# EAGLE design autonomous_vehicle_controller (EAGLE 7.1.0)
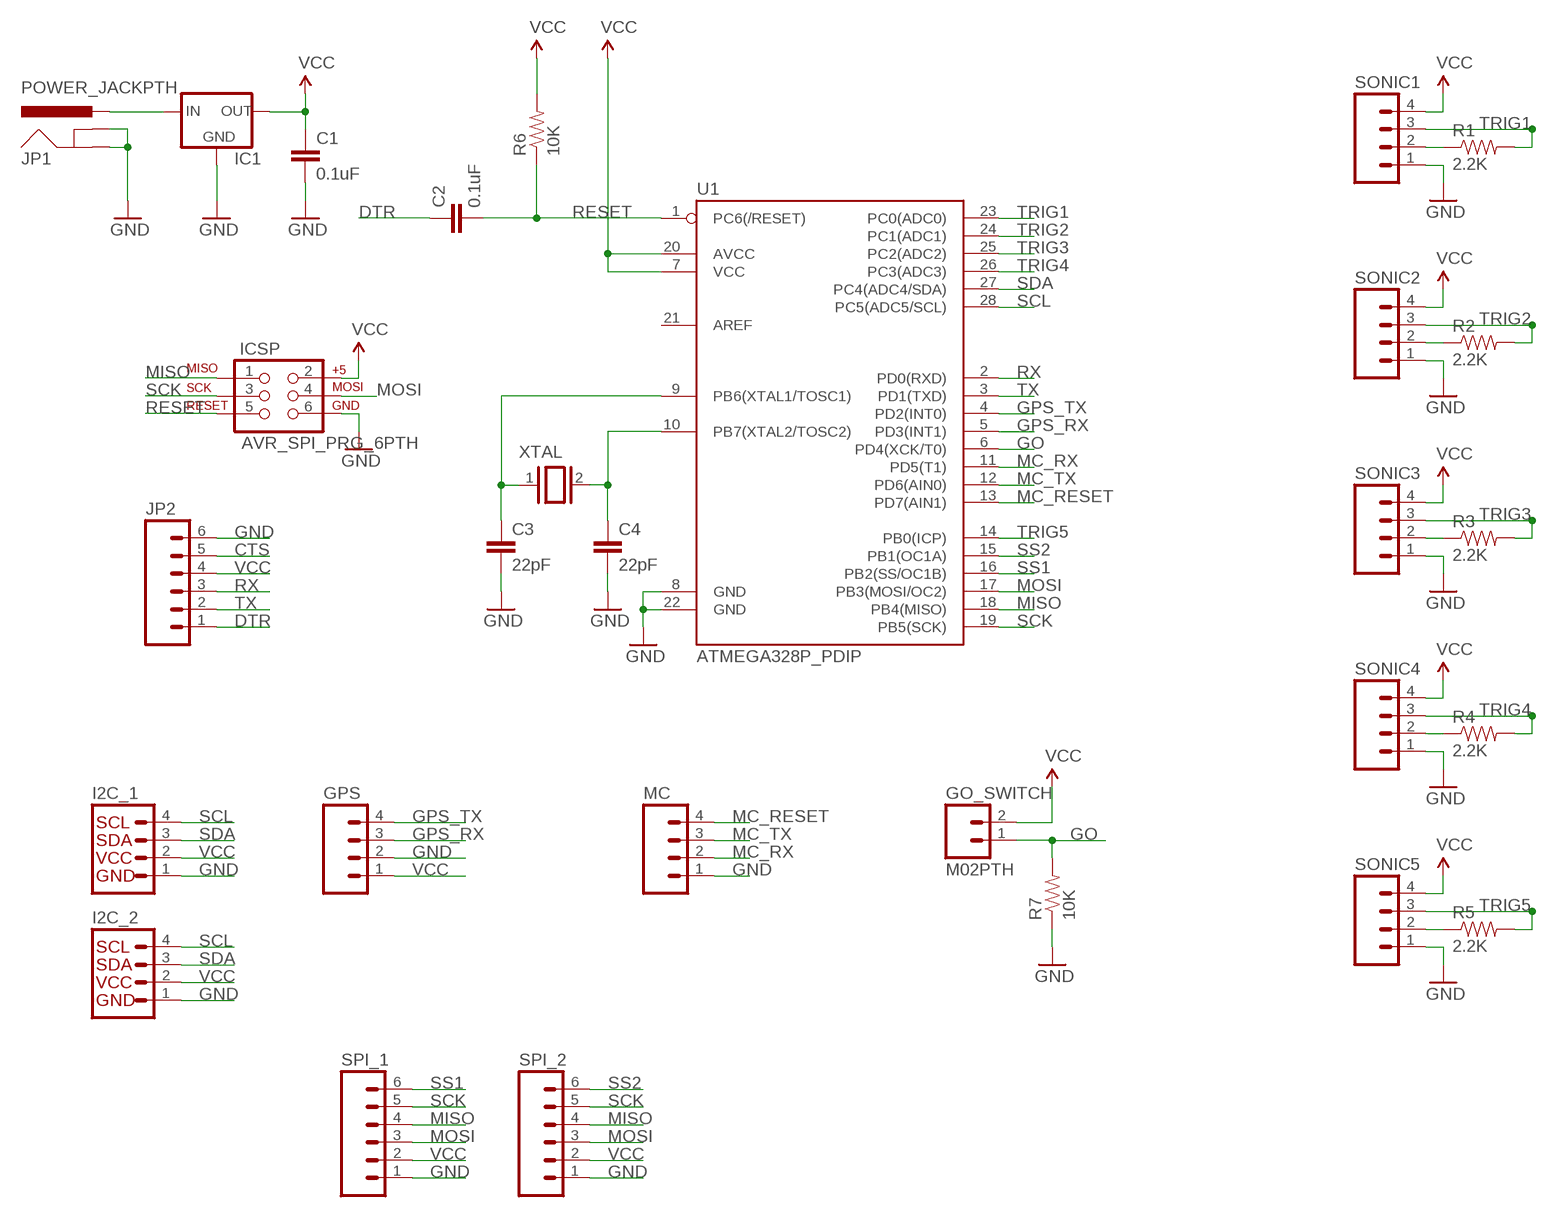
[diagram p0: schematic, sheet 1]

## Parts
C1  0.1uF  CAPPTH  [CAP-PTH-SMALL]
C2  0.1uF  CAPPTH  [CAP-PTH-SMALL]
C3  22pF  CAPPTH  [CAP-PTH-SMALL]
C4  22pF  CAPPTH  [CAP-PTH-SMALL]
GO_SWITCH  M02PTH  [1X02]
GPS  M04PTH  [1X04]
I2C_1  I2C_STANDARD  [1X04]
I2C_2  I2C_STANDARD  [1X04]
IC1  V_REG_78XXSIDE  [78XXL]
ICSP  AVR_SPI_PRG_6PTH  [2X3]
JP1  POWER_JACKPTH  [POWER_JACK_PTH]
JP2  M06SILK_FEMALE_PTH  [1X06]
MC  M04PTH  [1X04]
R1  2.2K  RESISTORPTH-1/4W  [AXIAL-0.4]
R2  2.2K  RESISTORPTH-1/4W  [AXIAL-0.4]
R3  2.2K  RESISTORPTH-1/4W  [AXIAL-0.4]
R4  2.2K  RESISTORPTH-1/4W  [AXIAL-0.4]
R5  2.2K  RESISTORPTH-1/4W  [AXIAL-0.4]
R6  10K  RESISTORPTH-1/4W  [AXIAL-0.4]
R7  10K  RESISTORPTH-1/4W  [AXIAL-0.4]
SONIC1  M04PTH  [1X04]
SONIC2  M04PTH  [1X04]
SONIC3  M04PTH  [1X04]
SONIC4  M04PTH  [1X04]
SONIC5  M04PTH  [1X04]
SPI_1  M06SILK_FEMALE_PTH  [1X06]
SPI_2  M06SILK_FEMALE_PTH  [1X06]
U1  ATMEGA328P_PDIP  [DIL28-3]
XTAL  XTAL/S  [QS]

## Nets
CTS: JP2.5
DTR: C2.1 JP2.1
GND: C1.2 C3.2 C4.2 GPS.2 I2C_1.1 I2C_2.1 IC1.GND ICSP.6 JP1.GND JP1.GNDBREAK JP2.6 MC.1 R7.P$1 SONIC1.1 SONIC2.1 SONIC3.1 SONIC4.1 SONIC5.1 SPI_1.1 SPI_2.1 U1.8(GND) U1.22(GND)
GO: GO_SWITCH.1 R7.P$2 U1.6(PD4(XCK/T0))
GPS_RX: GPS.3 U1.5(PD3(INT1))
GPS_TX: GPS.4 U1.4(PD2(INT0))
MC_RESET: MC.4 U1.13(PD7(AIN1))
MC_RX: MC.2 U1.11(PD5(T1))
MC_TX: MC.3 U1.12(PD6(AIN0))
MISO: ICSP.1 SPI_1.4 SPI_2.4 U1.18(PB4(MISO))
MOSI: ICSP.4 SPI_1.3 SPI_2.3 U1.17(PB3(MOSI/OC2))
N$1: IC1.IN JP1.PWR
N$2: C3.1 U1.9(PB6(XTAL1/TOSC1)) XTAL.1
N$3: R2.P$1 SONIC2.2
N$4: R1.P$1 SONIC1.2
N$5: R3.P$1 SONIC3.2
N$6: R4.P$1 SONIC4.2
N$7: R5.P$1 SONIC5.2
N$8: C4.1 U1.10(PB7(XTAL2/TOSC2)) XTAL.2
RESET: C2.2 ICSP.5 R6.P$1 U1.1(PC6(/RESET))
RX: JP2.3 U1.2(PD0(RXD))
SCK: ICSP.3 SPI_1.5 SPI_2.5 U1.19(PB5(SCK))
SCL: I2C_1.4 I2C_2.4 U1.28(PC5(ADC5/SCL))
SDA: I2C_1.3 I2C_2.3 U1.27(PC4(ADC4/SDA))
SS1: SPI_1.6 U1.16(PB2(SS/OC1B))
SS2: SPI_2.6 U1.15(PB1(OC1A))
TRIG1: R1.P$2 SONIC1.3 U1.23(PC0(ADC0))
TRIG2: R2.P$2 SONIC2.3 U1.24(PC1(ADC1))
TRIG3: R3.P$2 SONIC3.3 U1.25(PC2(ADC2))
TRIG4: R4.P$2 SONIC4.3 U1.26(PC3(ADC3))
TRIG5: R5.P$2 SONIC5.3 U1.14(PB0(ICP))
TX: JP2.2 U1.3(PD1(TXD))
VCC: C1.1 GO_SWITCH.2 GPS.1 I2C_1.2 I2C_2.2 IC1.OUT ICSP.2 JP2.4 R6.P$2 SONIC1.4 SONIC2.4 SONIC3.4 SONIC4.4 SONIC5.4 SPI_1.2 SPI_2.2 U1.7(VCC) U1.20(AVCC)
Unconnected: U1.21(AREF)

## Library data of the parts
C1 C2 = SparkFun-Capacitors:CAP: Capacitor Standard 0603 ceramic capacitor, and 0.1" leaded capacitor.
C3 C4 = SparkFun-Passives:CAP: Capacitor Standard 0603 ceramic capacitor, and 0.1" leaded capacitor.
GO_SWITCH = SparkFun-Connectors:M02: Standard 2-pin 0.1" header. Use with - straight break away headers ( PRT-00116) - right angle break away headers (PRT-00553) - swiss pins (PRT-00743) - machine pins (PRT-00117) - female headers (PRT-00115) Molex polarized connector foot print use with: PRT-08233 with associated crimp pins and housings. 2.54_SCREWTERM for use with PRT-10571. 3.5mm Screw Terminal footprints for PRT-08084 5mm Screw Terminal footprints for use with PRT-08432
GPS MC SONIC1-SONIC5 = SparkFun-Connectors:M04: Header 4 Standard 4-pin 0.1" header. Use with straight break away headers (SKU : PRT-00116), right angle break away headers (PRT-00553), swiss pins (PRT-00743), machine pins (PRT-00117), and female headers (PRT-00115). Molex polarized connector foot print use with SKU : PRT-08231 with associated crimp pins and housings. 1MM SMD Version SKU: PRT-10208
I2C_1 I2C_2 = SparkFun-Connectors:I2C_STANDARD: SparkFun has standardized on a pinout for all I2C based sensor breakouts. This pinout allows I2C boards to be plugged directly into the headers on Arduino Uno compatible boards, and to be daisy chained easily.
IC1 = SparkFun-PowerIC:V_REG_78XX: Voltage Regulator Standard 7805 5V regulator. IGO (Input Ground Output). Spark Fun Electronics SKU : COM-00107
ICSP = SparkFun-Connectors:AVR_SPI_PRG_6: AVR ISP 6 Pin This is the reduced ISP connector for AVR programming. Common on Arduino. This footprint will take up less PCB space and can be used with a 10-pin to 6-pin adapter such as SKU: BOB-08508 **Special note about "TEST_POINT" package. The stop mask is on the top side, so if you want your programming test points to be on the bottom of your board, make sure to place this package on the bottom side of the board. This also ensure that the orientation to program from the bottom side will be correct.
JP1 = SparkFun-Connectors:POWER_JACK: Power Jack This is the standard 5.5mm barrel jack for power. The PTH is the most common, proven, reliable, footprint. The Slot footprint only works if the mill layer is transmitted to the PCB fab house so be warned. Mating wall wart : TOL-00298 (and others); PROD_ID: CONN-08197
JP2 SPI_1 SPI_2 = SparkFun-Connectors:M06: Header 6 Standard 6-pin 0.1" header. Use with straight break away headers (SKU : PRT-00116), right angle break away headers (PRT-00553), swiss pins (PRT-00743), machine pins (PRT-00117), and female headers (PRT-00115). Molex polarized connector foot print use with SKU : PRT-08094 with associated crimp pins and housings. NOTES ON THE VARIANTS LOCK and LOCK_LONGPADS... This footprint was designed to help hold the alignment of a through-hole component (i.e. 6-pin header) while soldering it into place. You may notice that each hole has been shifted either up or down by 0.005 of an inch from it's more standard position (which is a perfectly straight line). This slight alteration caused the pins (the squares in the middle) to touch the edges of the holes. Because they are alternating, it causes a "brace" to hold the component in place. 0.005 has proven to be the perfect amount of "off-center" position when using our standard breakaway headers. Although looks a little odd when you look at the bare footprint, once you have a header in there, the alteration is very hard to notice. Also,if you push a header all the way into place, it is covered up entirely on the bottom side. This idea of altering the position of holes to aid alignment will be further integrated into the Sparkfun Library for other footprints. It can help hold any component with 3 or more connection pins.; PROD_ID: CONN-08437
R1-R7 = SparkFun-Passives:RESISTOR: Resistor Basic schematic elements and footprints for 0603, 1206, and PTH resistors.
U1 = SparkFun-DigitalIC:ATMEGA328P_PDIP: uC used in the Arduino 32kb flash, 1k EEPROM, 2k SRAM This is the through-hole version of this chip.
XTAL = special:XTAL/S: CRYSTAL

## Board
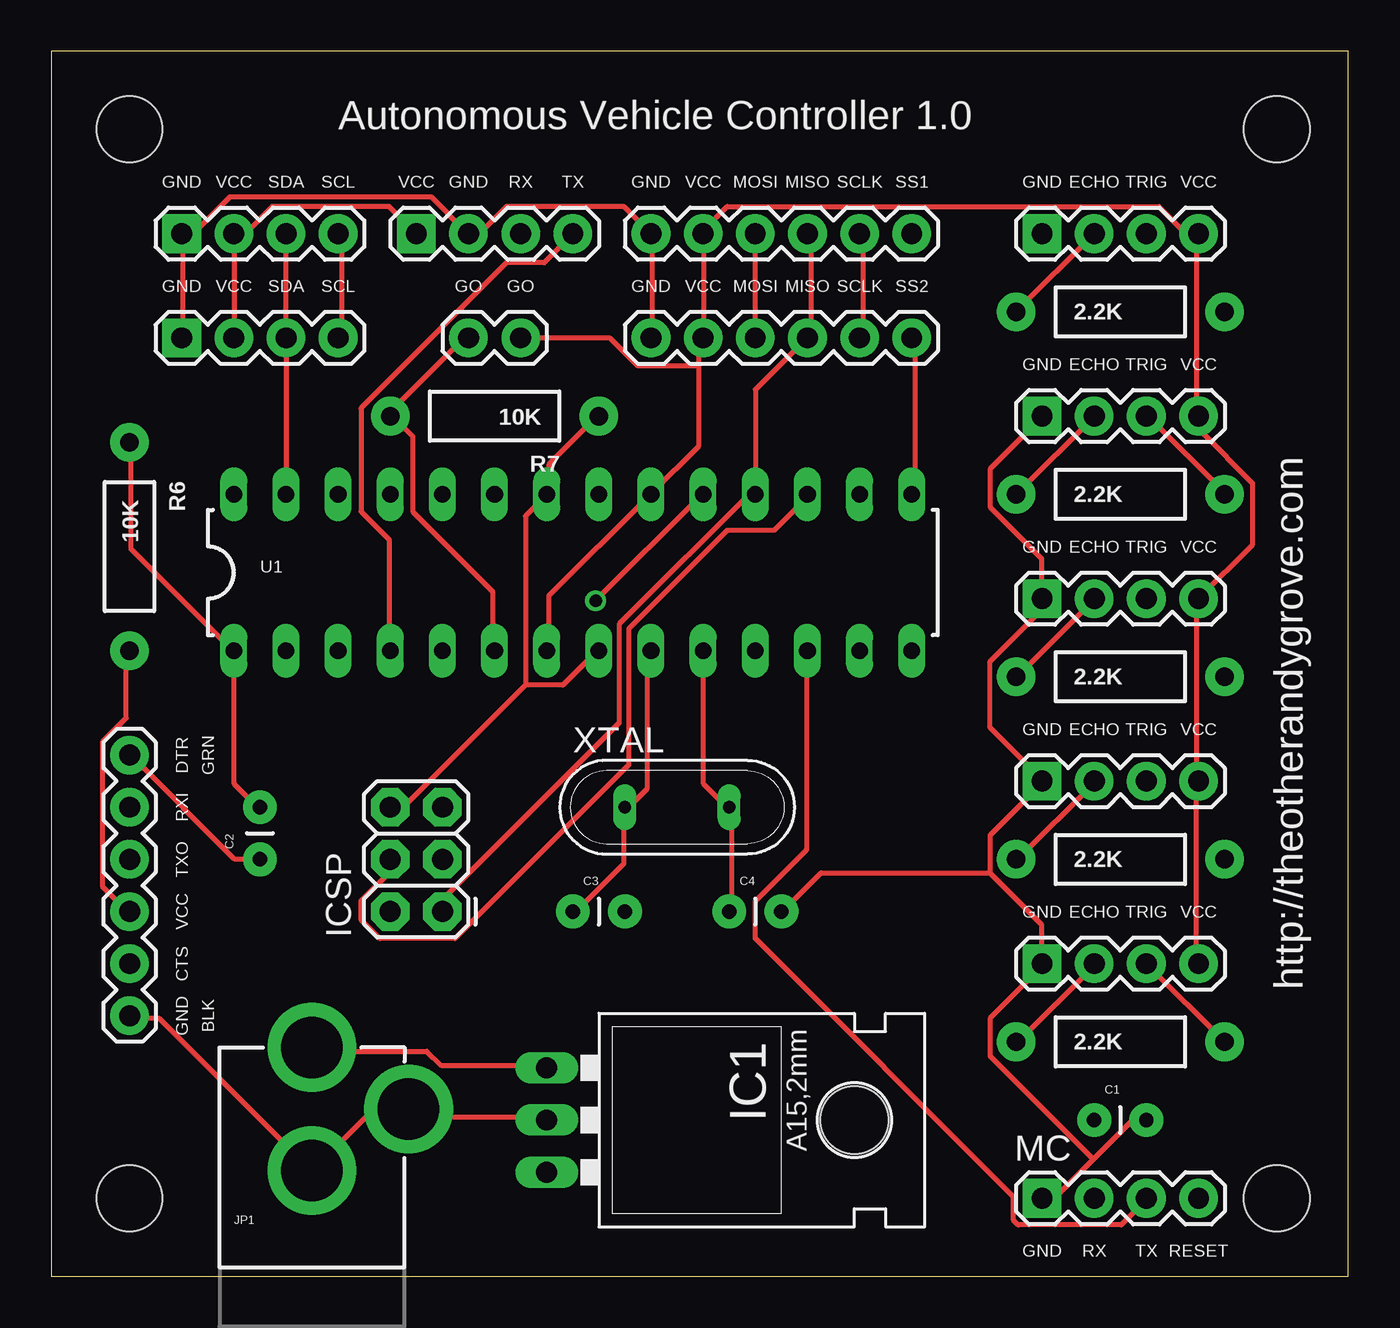
[diagram p1: board, top side]
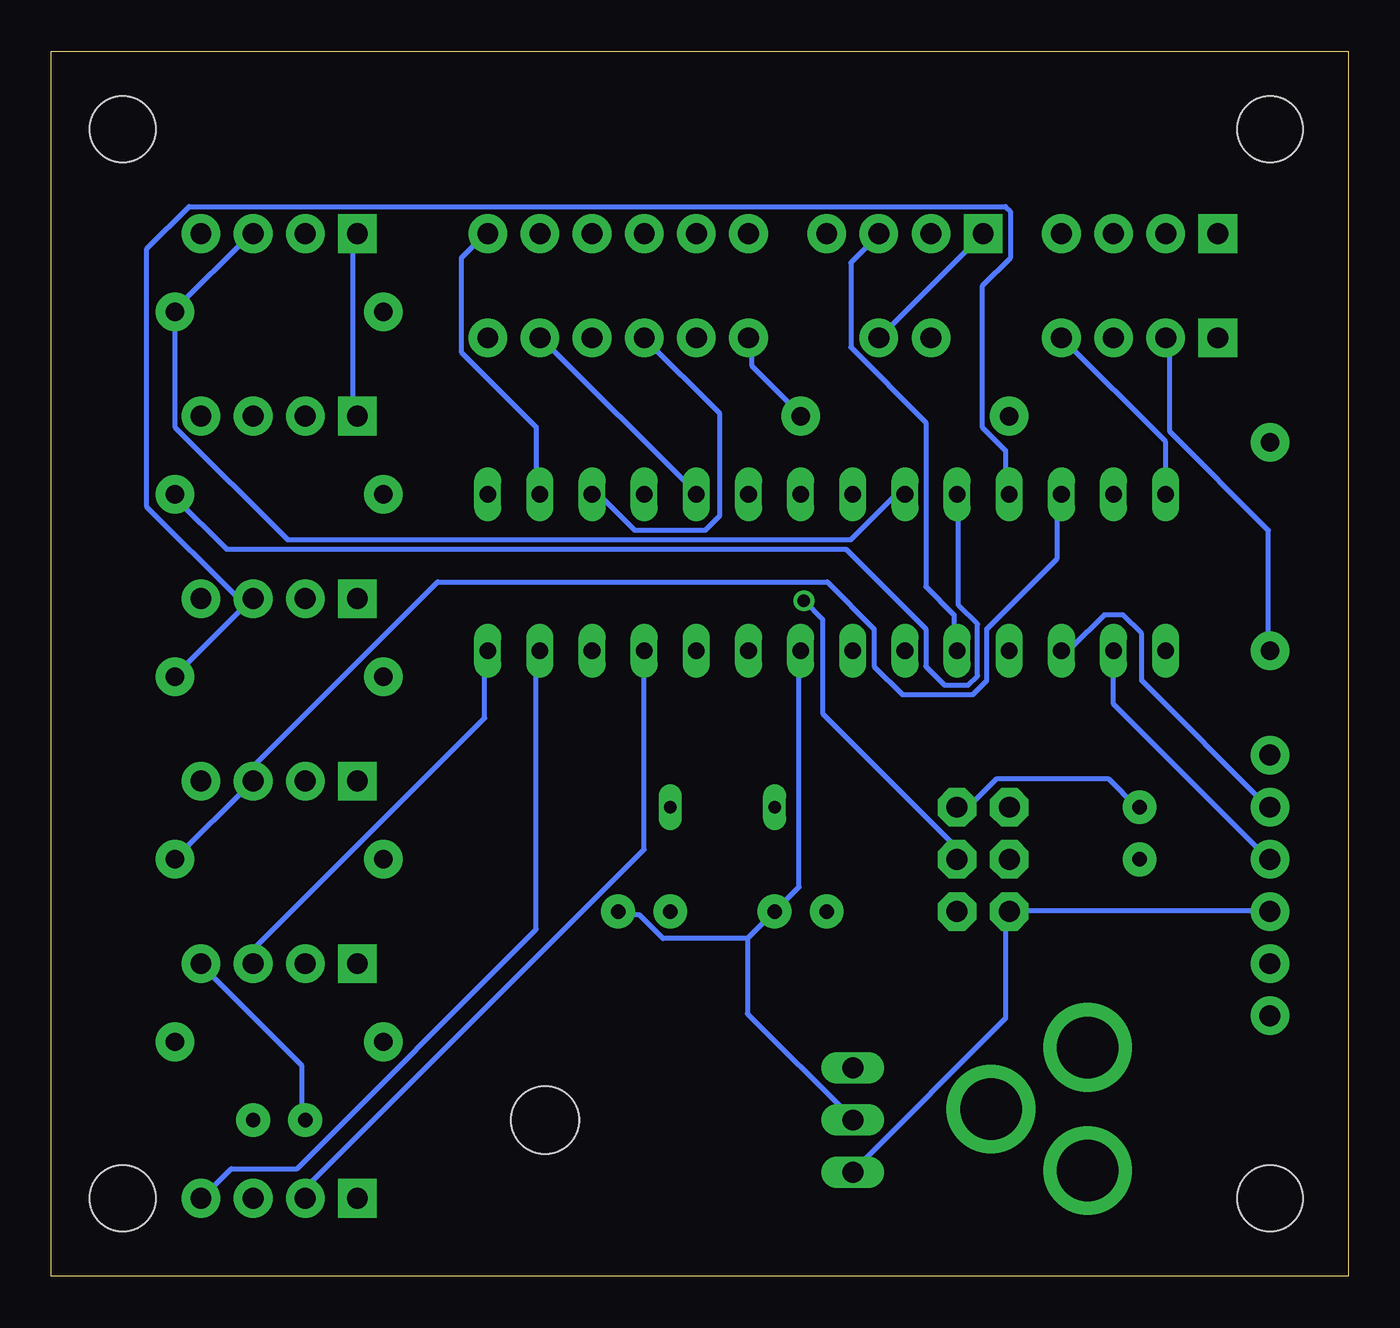
[diagram p2: board, bottom side, seen from below]

Size 63.17 x 59.68 mm. Coordinates in mm from the lower left corner, seen from the top.
Outline: 0,0 63.17,0 63.17,59.68 0,59.68 0,0
Copper layers (1*16): Top 0.035mm / dielectric 1.5mm / Bottom 0.035mm
Design rules "default": minimum track width 10mil, minimum drill 24mil, track to track 8mil, track to pad 8mil, pad to pad 8mil, via to via 8mil, smd to smd 8mil, copper to edge 40mil, drill to drill 8mil, minimum pad ring 10mil, minimum via ring 8mil, stop-mask expansion 4mil, vias tented up to drill 0mil, thermal gap 10mil
Holes 3.2 mm at 3.81,55.88 59.69,55.88 59.69,3.81 3.81,3.81

### Footprints (pad centres in the part's own frame; a part is rotated, then mirrored left to right if it is on the bottom)
CAP-PTH-SMALL = drill 0.7 pad 1.651: 1 0,0; 2 2.54,0
1X02 = drill 1.016 pad 1.88: 1 0,0; 2 2.54,0
1X04 = drill 1.016 pad 1.88 square: 1 0,0 | drill 1.016 pad 1.88: 2 2.54,0; 3 5.08,0; 4 7.62,0
78XXL = drill 1.016 long: GND 0,-3.81; IN -2.54,-3.81; OUT 2.54,-3.81 | hole 3.302: 0,11.176
2X3 = drill 1.016 pad 1.88 octagon: 1 0,0; 2 0,2.54; 3 2.54,0; 4 2.54,2.54; 5 5.08,0; 6 5.08,2.54
POWER_JACK_PTH = drill 2.997 pad 4.318: GND 0,7.7; GNDBREAK 4.7,10.7; PWR 0,13.7
1X06 = drill 1.016 pad 1.88: 1 0,0; 2 2.54,0; 3 5.08,0; 4 7.62,0; 5 10.16,0; 6 12.7,0
AXIAL-0.4 = drill 0.9 pad 1.88: P$1 -5.08,0; P$2 5.08,0
DIL28-3 = drill 0.813 long: 1 -16.51,-3.81; 2 -13.97,-3.81; 3 -11.43,-3.81; 4 -8.89,-3.81; 5 -6.35,-3.81; 6 -3.81,-3.81; 7 -1.27,-3.81; 8 1.27,-3.81; 9 3.81,-3.81; 10 6.35,-3.81; 11 8.89,-3.81; 12 11.43,-3.81; 13 13.97,-3.81; 14 16.51,-3.81; 15 16.51,3.81; 16 13.97,3.81; 17 11.43,3.81; 18 8.89,3.81; 19 6.35,3.81; 20 3.81,3.81; 21 1.27,3.81; 22 -1.27,3.81; 23 -3.81,3.81; 24 -6.35,3.81; 25 -8.89,3.81; 26 -11.43,3.81; 27 -13.97,3.81; 28 -16.51,3.81
QS = drill 0.61 long: 1 -2.54,0; 2 2.54,0

### Placement (x,y rotation side)
C1  50.8,7.62 0 top
C2  10.16,20.32 90 top
C3  25.4,17.78 0 top
C4  33.02,17.78 0 top
GO_SWITCH  20.32,45.72 0 top
GPS  17.78,50.8 0 top
I2C_1  6.35,50.8 0 top
I2C_2  6.35,45.72 0 top
IC1  27.94,7.62 270 top
ICSP  19.05,17.78 90 top
JP1  12.7,-2.54 0 top
JP2  3.81,25.4 270 top
MC  48.26,3.81 0 top
R1  52.07,46.99 0 top
R2  52.07,38.1 0 top
R3  52.07,29.21 0 top
R4  52.07,20.32 0 top
R5  52.07,11.43 0 top
R6  3.81,35.56 270 top
R7  21.59,41.91 180 top
SONIC1  48.26,50.8 0 top
SONIC2  48.26,41.91 0 top
SONIC3  48.26,33.02 0 top
SONIC4  48.26,24.13 0 top
SONIC5  48.26,15.24 0 top
SPI_1  29.21,50.8 0 top
SPI_2  29.21,45.72 0 top
U1  25.4,34.29 0 top
XTAL  30.48,22.86 0 top

### Tracks (layer width: path | path; a pad name or v marks a point on that pad's centre or on a via)
DTR
  Top 0.254: C2.1 10.06,20.34 8.91,20.34 3.89,25.38 JP2.1
GND
  Top 0.254: SONIC2.1 48.23,41.83 45.72,39.32 45.72,37.49 48.23,34.98 48.23,33.15 SONIC3.1 48.23,32.92 48.23,32.46 45.72,29.95 45.72,26.75 48.23,24.23 SONIC4.1 48.23,24 45.72,21.49 45.72,19.66 | 50.75,5.71 48.92,3.89 48.46,3.89 MC.1 | 50.75,5.71 52.58,7.54 53.26,7.54 C1.2 | 45.72,19.66 48.23,17.14 48.23,15.32 SONIC5.1 48.23,15.09 45.72,12.57 45.72,10.74 50.75,5.71 | IC1.GND 24,7.77 17.83,7.77 17.6,8 JP1.GNDBREAK 17.37,8 15.54,8 12.8,5.26 JP1.GND 12.57,5.26 5.26,12.57 3.89,12.57 JP2.6 | ICSP.6 17.14,22.86 23.09,28.8 | 23.09,28.8 24.92,28.8 26.52,30.4 U1.8 | R7.P$1 26.52,41.83 24.23,39.55 24.23,38.18 U1.22 24,37.95 23.09,37.03 23.09,28.8 | I2C_2.1 6.4,45.72 6.4,50.75 I2C_1.1 6.4,50.98 7.09,50.98 8.69,52.58 18.52,52.58 20.12,50.98 GPS.2 20.34,50.98 21.03,50.98 22.17,52.12 27.89,52.12 SPI_1.1 29.26,50.75 29.26,45.72 SPI_2.1 | 45.72,19.66 37.49,19.66 35.66,17.83 C4.2
  Bottom 0.254: SONIC1.1 48.46,50.75 48.46,42.06 SONIC2.1 | U1.8 26.75,30.4 26.75,18.97 C3.2 29.26,16.46 | 29.26,16.46 33.38,16.46 34.52,17.6 35.43,17.6 C4.2 | SPI_2.1 29.03,45.72 29.03,44.35 26.75,42.06 R7.P$1 | 29.26,16.46 29.26,12.8 24.23,7.77 IC1.GND
GO
  Top 0.254: U1.6 21.49,30.63 21.49,33.38 17.6,37.26 17.6,40.92 16.69,41.83 R7.P$2 16.46,42.06 20.12,45.72 GO_SWITCH.1
GPS_RX
  Bottom 0.254: U1.5 19.2,30.63 19.2,32.23 20.57,33.6 20.57,41.6 24.23,45.26 24.23,49.38 22.86,50.75 GPS.3
GPS_TX
  Top 0.254: U1.4 16.46,30.63 16.46,35.89 15.09,37.26 15.09,42.29 22.17,49.38 24,49.38 25.38,50.75 GPS.4
MC_RESET
  Bottom 0.254: U1.13 39.55,30.4 39.55,16.92 51.21,5.26 54.41,5.26 55.78,3.89 MC.4
MC_RX
  Bottom 0.254: U1.11 34.29,20.8 50.75,4.34 50.75,3.89 MC.2
MC_TX
  Top 0.254: U1.12 36.8,30.4 36.8,20.8 34.29,18.29 34.29,16.46 46.86,3.89 46.86,2.74 47.09,2.52 52.12,2.52 53.26,3.66 MC.3
MISO
  Top 0.254: 34.29,38.41 34.29,43.2 36.8,45.72 SPI_2.4 37.03,45.72 37.03,50.75 SPI_1.4 | 34.29,38.41 U1.18 34.29,38.18 | 34.29,38.41 27.66,31.77 27.66,26.98 19.2,18.52 19.2,17.83 ICSP.1
MOSI
  Top 0.254: ICSP.4 16.46,20.12 16.46,19.66 15.09,18.29 15.09,17.37 16,16.46 19.66,16.46 28.12,24.92 28.12,31.55 32.92,36.35 35.2,36.35 36.8,37.95 U1.17 | SPI_2.3 SPI_1.3
  Bottom 0.254: SPI_2.3 30.63,42.06 30.63,37.03 31.32,36.35 34.75,36.35 36.35,37.95 36.8,37.95 U1.17
N$1
  Top 0.254: IC1.IN 24,10.29 18.97,10.29 18.29,10.97 12.8,10.97 JP1.PWR
N$2
  Top 0.254: C3.1 25.6,17.83 27.89,20.12 27.89,22.86 XTAL.1 28.12,22.86 29.03,23.77 29.03,30.4 U1.9
N$3
  Top 0.254: R2.P$1 47.09,38.18 50.75,41.83 SONIC2.2
N$4
  Top 0.254: SONIC1.2 R1.P$1
N$5
  Top 0.254: R3.P$1 47.09,29.26 50.75,32.92 SONIC3.2
N$6
  Top 0.254: R4.P$1 47.09,20.34 50.75,24 SONIC4.2
N$7
  Top 0.254: R5.P$1 47.09,11.43 50.75,15.09 SONIC5.2
N$8
  Top 0.254: C4.1 33.15,17.83 33.15,22.86 XTAL.2 32.92,22.86 31.77,24 31.77,30.4 U1.10
RESET
  Top 0.254: C2.2 10.06,22.86 8.91,24 8.91,30.4 U1.1 8.69,30.63 3.89,35.43 3.89,40.46 R6.P$1
  Bottom 0.254: ICSP.5 18.52,22.86 17.14,24.23 11.66,24.23 10.29,22.86 C2.2
RX
  Bottom 0.254: U1.2 11.43,27.89 3.89,20.34 JP2.3
SCK  (via drill 0.61)
  Top 0.254: v26.52,32.92 31.55,37.95 U1.19 | SPI_1.5 39.55,50.75 39.55,45.72 SPI_2.5
  Bottom 0.254: U1.19 31.77,38.18 39.32,45.72 SPI_2.5 | v26.52,32.92 25.6,32 25.6,27.43 19.2,21.03 19.2,20.34 ICSP.3
SCL
  Top 0.254: I2C_1.4 14.17,50.75 14.17,45.72 I2C_2.4
  Bottom 0.254: U1.28 8.91,38.18 8.91,40.69 13.95,45.72 I2C_2.4
SDA
  Top 0.254: U1.27 I2C_2.3 I2C_1.3
SS1
  Bottom 0.254: U1.16 39.55,38.18 39.55,41.38 43.2,45.03 43.2,49.61 42.06,50.75 SPI_1.6
SS2
  Top 0.254: U1.15 42.06,38.18 42.06,45.72 SPI_2.6
TRIG1
  Bottom 0.254: U1.23 21.72,37.95 22.17,37.95 24.23,35.89 51.66,35.89 57.15,41.38 R1.P$2 57.15,47.09 53.49,50.75 SONIC1.3
TRIG2
  Top 0.254: SONIC2.3 53.49,41.83 57.15,38.18 R2.P$2
  Bottom 0.254: U1.24 18.97,37.95 18.97,32.69 18.06,31.77 18.06,29.26 18.52,28.8 19.66,28.8 20.57,29.72 20.57,31.55 24.46,35.43 54.63,35.43 57.15,37.95 R2.P$2
TRIG3
  Bottom 0.254: U1.25 16.69,38.18 16.69,40.23 17.83,41.38 17.83,48.23 16.46,49.61 16.46,51.89 16.69,52.12 56.46,52.12 58.52,50.06 58.52,37.49 54.18,33.15 53.49,33.15 SONIC3.3 53.49,32.92 57.15,29.26 R3.P$2
TRIG4
  Bottom 0.254: U1.26 14.17,37.95 14.17,34.98 17.6,31.55 17.6,29.03 18.29,28.35 21.72,28.35 23.09,29.72 23.09,31.55 25.38,33.83 44.35,33.83 53.26,24.92 53.26,24.23 SONIC4.3 53.49,24 57.15,20.34 R4.P$2
TRIG5
  Top 0.254: SONIC5.3 R5.P$2
  Bottom 0.254: U1.14 42.06,30.4 42.06,27.2 53.26,16 53.26,15.32 SONIC5.3
TX
  Bottom 0.254: U1.3 13.95,30.63 13.49,30.63 11.89,32.23 10.97,32.23 10.06,31.32 10.06,29.03 3.89,22.86 JP2.2
VCC
  Top 0.254: SONIC5.4 55.78,15.32 55.78,24 SONIC4.4 55.78,24.23 55.78,32.92 SONIC3.4 58.52,35.66 58.52,38.63 56.01,41.15 56.01,41.83 SONIC2.4 55.78,42.06 55.78,50.75 SONIC1.4 55.78,50.98 55.09,50.98 53.95,52.12 32.92,52.12 31.77,50.98 SPI_1.2 31.77,50.75 31.77,45.72 SPI_2.2 31.55,45.72 31.55,44.35 | I2C_2.2 8.91,45.72 8.91,50.75 I2C_1.2 8.91,50.98 9.6,50.98 10.74,52.12 16.46,52.12 GPS.1 | U1.7 24.23,30.63 24.23,33.15 29.03,37.95 U1.20 29.26,38.18 31.55,40.46 31.55,44.35 | GO_SWITCH.2 27.2,45.72 28.57,44.35 31.55,44.35 | R6.P$2 3.66,30.4 3.66,27.2 2.52,26.06 2.52,18.97 3.66,17.83 JP2.4
  Bottom 0.254: C1.1 50.98,7.77 50.98,10.29 55.78,15.09 SONIC5.4 | GPS.1 GO_SWITCH.2 | IC1.OUT 24,5.26 16.69,12.57 16.69,17.6 ICSP.2 16.46,17.83 3.89,17.83 JP2.4 | I2C_2.2 8.69,45.72 8.69,41.15 3.89,36.35 3.89,30.63 R6.P$2

### Text on the board
tNames: Autonomous Vehicle Controller 1.0 | GND | VCC | SDA | SCL | VCC | GND | RX | TX | GND | VCC | MOSI | MISO | SCLK | SS1 | GND | ECHO | TRIG | VCC | GND | VCC | SDA | SCL | GO | GO | GND | VCC | MOSI | MISO | SCLK | SS2 | GND | ECHO | TRIG | VCC | GND | ECHO | TRIG | VCC | GND | ECHO | TRIG | VCC | DTR | GRN | RXI | TXO | VCC | GND | ECHO | TRIG | VCC | CTS | http://theotherandygrove.com | GND | BLK | GND | RX | TX | RESET